# EAGLE design EEPROM_Programmer (EAGLE 9.6.2)

## Sheet 1 of 3: USB to UART and Microcontroller
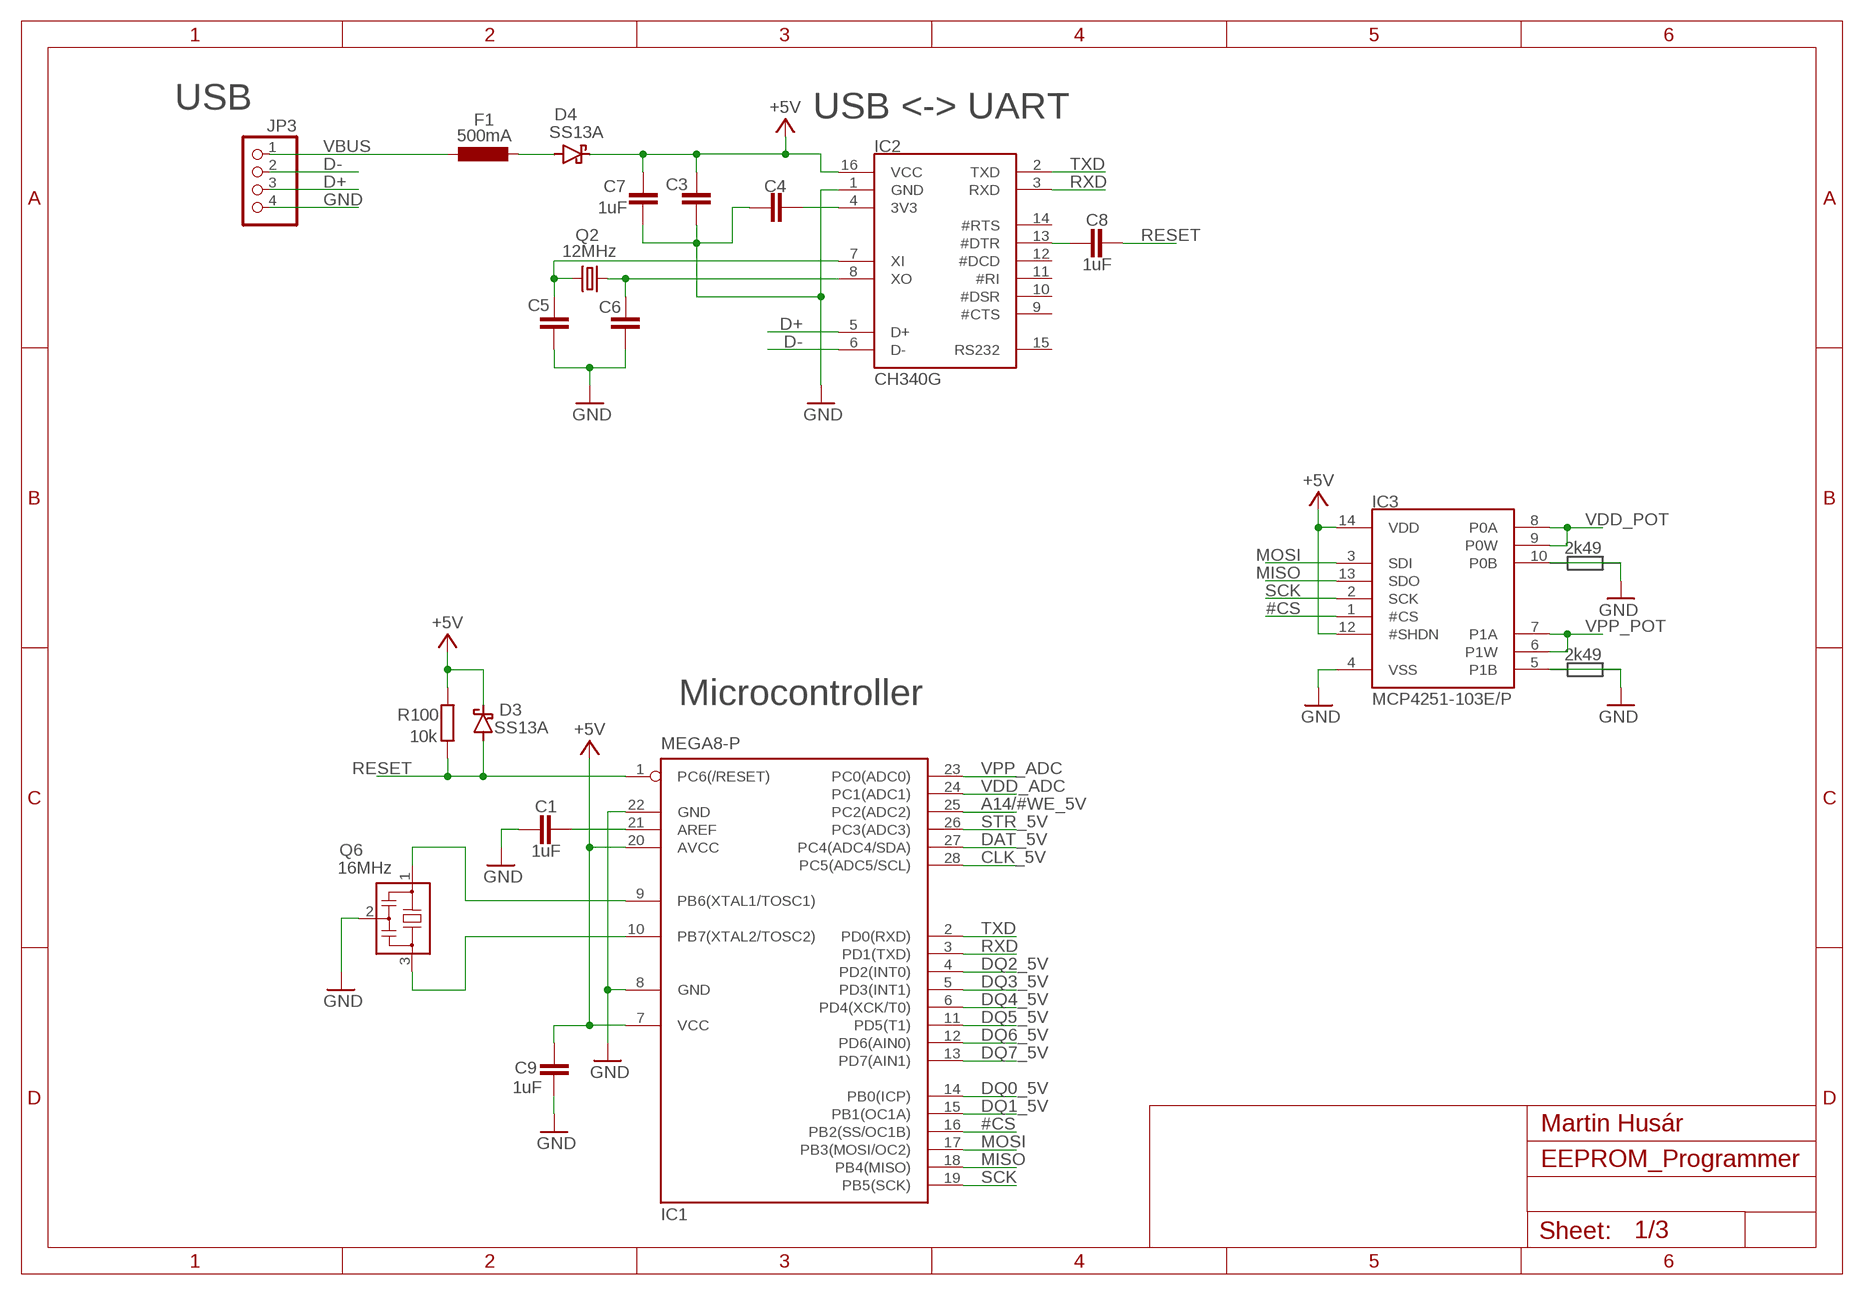
[diagram p0: schematic, sheet 1]

### Parts
C1  1uF  C-EUC0805  [C0805]
C3  C-EUC0603  [C0603]
C4  C-EUC0603  [C0603]
C5  C-EUC0603  [C0603]
C6  C-EUC0603  [C0603]
C7  1uF  C-EUC0805  [C0805]
C8  1uF  C-EUC0805  [C0805]
C9  1uF  C-EUC0805  [C0805]
D3  SS13A  CGRM4001-G  [SOD-123_MINI-SMA]
D4  SS13A  CGRM4001-G  [SOD-123_MINI-SMA]
F1  500mA  L-EUL1812  [L1812]
IC1  MEGA8-P  [DIL28-3]
IC2  CH340G  [SOP16]
IC3  MCP4251-103E/P  MCP425X  [DIL14]
JP3  PINHD-1X4  [1X04]
Q2  12MHz  CRYSTALHC49U-V  [HC49U-V]
Q6  16MHz  ZTTCS16.00MX  [ZTTCS*MX]
R100  10k  R-EU_R0805  [R0805]

### Nets
#CS: IC1.16(PB2(SS/OC1B)) IC3.1(#CS)
+5V [+5V]: C3.2 C7.2 C9.2 D3.C D4.C IC1.7(VCC) IC1.20(AVCC) IC2.16(VCC) IC3.12(#SHDN) IC3.14(VDD) R100.2 ; also sheet 2,3
A14/#WE_5V: IC1.25(PC2(ADC2)) ; also sheet 3
CLK_5V: IC1.28(PC5(ADC5/SCL)) ; also sheet 2
D+: IC2.5(D+) JP3.3
D-: IC2.6(D-) JP3.2
DAT_5V: IC1.27(PC4(ADC4/SDA)) ; also sheet 2
DQ0_5V: IC1.14(PB0(ICP)) ; also sheet 3
DQ1_5V: IC1.15(PB1(OC1A)) ; also sheet 3
DQ2_5V: IC1.4(PD2(INT0)) ; also sheet 3
DQ3_5V: IC1.5(PD3(INT1)) ; also sheet 3
DQ4_5V: IC1.6(PD4(XCK/T0)) ; also sheet 3
DQ5_5V: IC1.11(PD5(T1)) ; also sheet 3
DQ6_5V: IC1.12(PD6(AIN0)) ; also sheet 3
DQ7_5V: IC1.13(PD7(AIN1)) ; also sheet 3
GND [+5V]: C1.1 C3.1 C4.2 C5.2 C6.2 C7.1 C9.1 IC1.8(GND) IC1.22(GND) IC2.1(GND) IC3.4(VSS) IC3.5(P1B) IC3.10(P0B) JP3.4 Q6.2 ; also sheet 2,3
MISO: IC1.18(PB4(MISO)) IC3.13(SDO)
MOSI: IC1.17(PB3(MOSI/OC2)) IC3.3(SDI)
N$1: IC1.9(PB6(XTAL1/TOSC1)) Q6.1
N$2: IC1.10(PB7(XTAL2/TOSC2)) Q6.3
N$3: C1.2 IC1.21(AREF)
N$4: C8.1 IC2.13(#DTR)
N$5: C5.1 IC2.7(XI) Q2.2
N$9: C6.1 IC2.8(XO) Q2.1
N$11: C4.1 IC2.4(3V3)
N$14: D4.A F1.2
RESET: C8.2 D3.A IC1.1(PC6(/RESET)) R100.1
RXD: IC1.3(PD1(TXD)) IC2.3(RXD)
SCK: IC1.19(PB5(SCK)) IC3.2(SCK)
STR_5V: IC1.26(PC3(ADC3)) ; also sheet 2
TXD: IC1.2(PD0(RXD)) IC2.2(TXD)
VBUS: F1.1 JP3.1
VDD_ADC: IC1.24(PC1(ADC1)) ; also sheet 2
VDD_POT: IC3.8(P0A) IC3.9(P0W) ; also sheet 2
VPP_ADC: IC1.23(PC0(ADC0)) ; also sheet 2
VPP_POT: IC3.6(P1W) IC3.7(P1A) ; also sheet 2
Unconnected: IC2.9(#CTS) IC2.10(#DSR) IC2.11(#RI) IC2.12(#DCD) IC2.14(#RTS) IC2.15(RS232)

### Notes on the sheet
- USB | USB <-> UART
- 2k49
- 2k49
- Microcontroller
- Martin Husár

## Sheet 2 of 3: Shift refisters and voltage converters
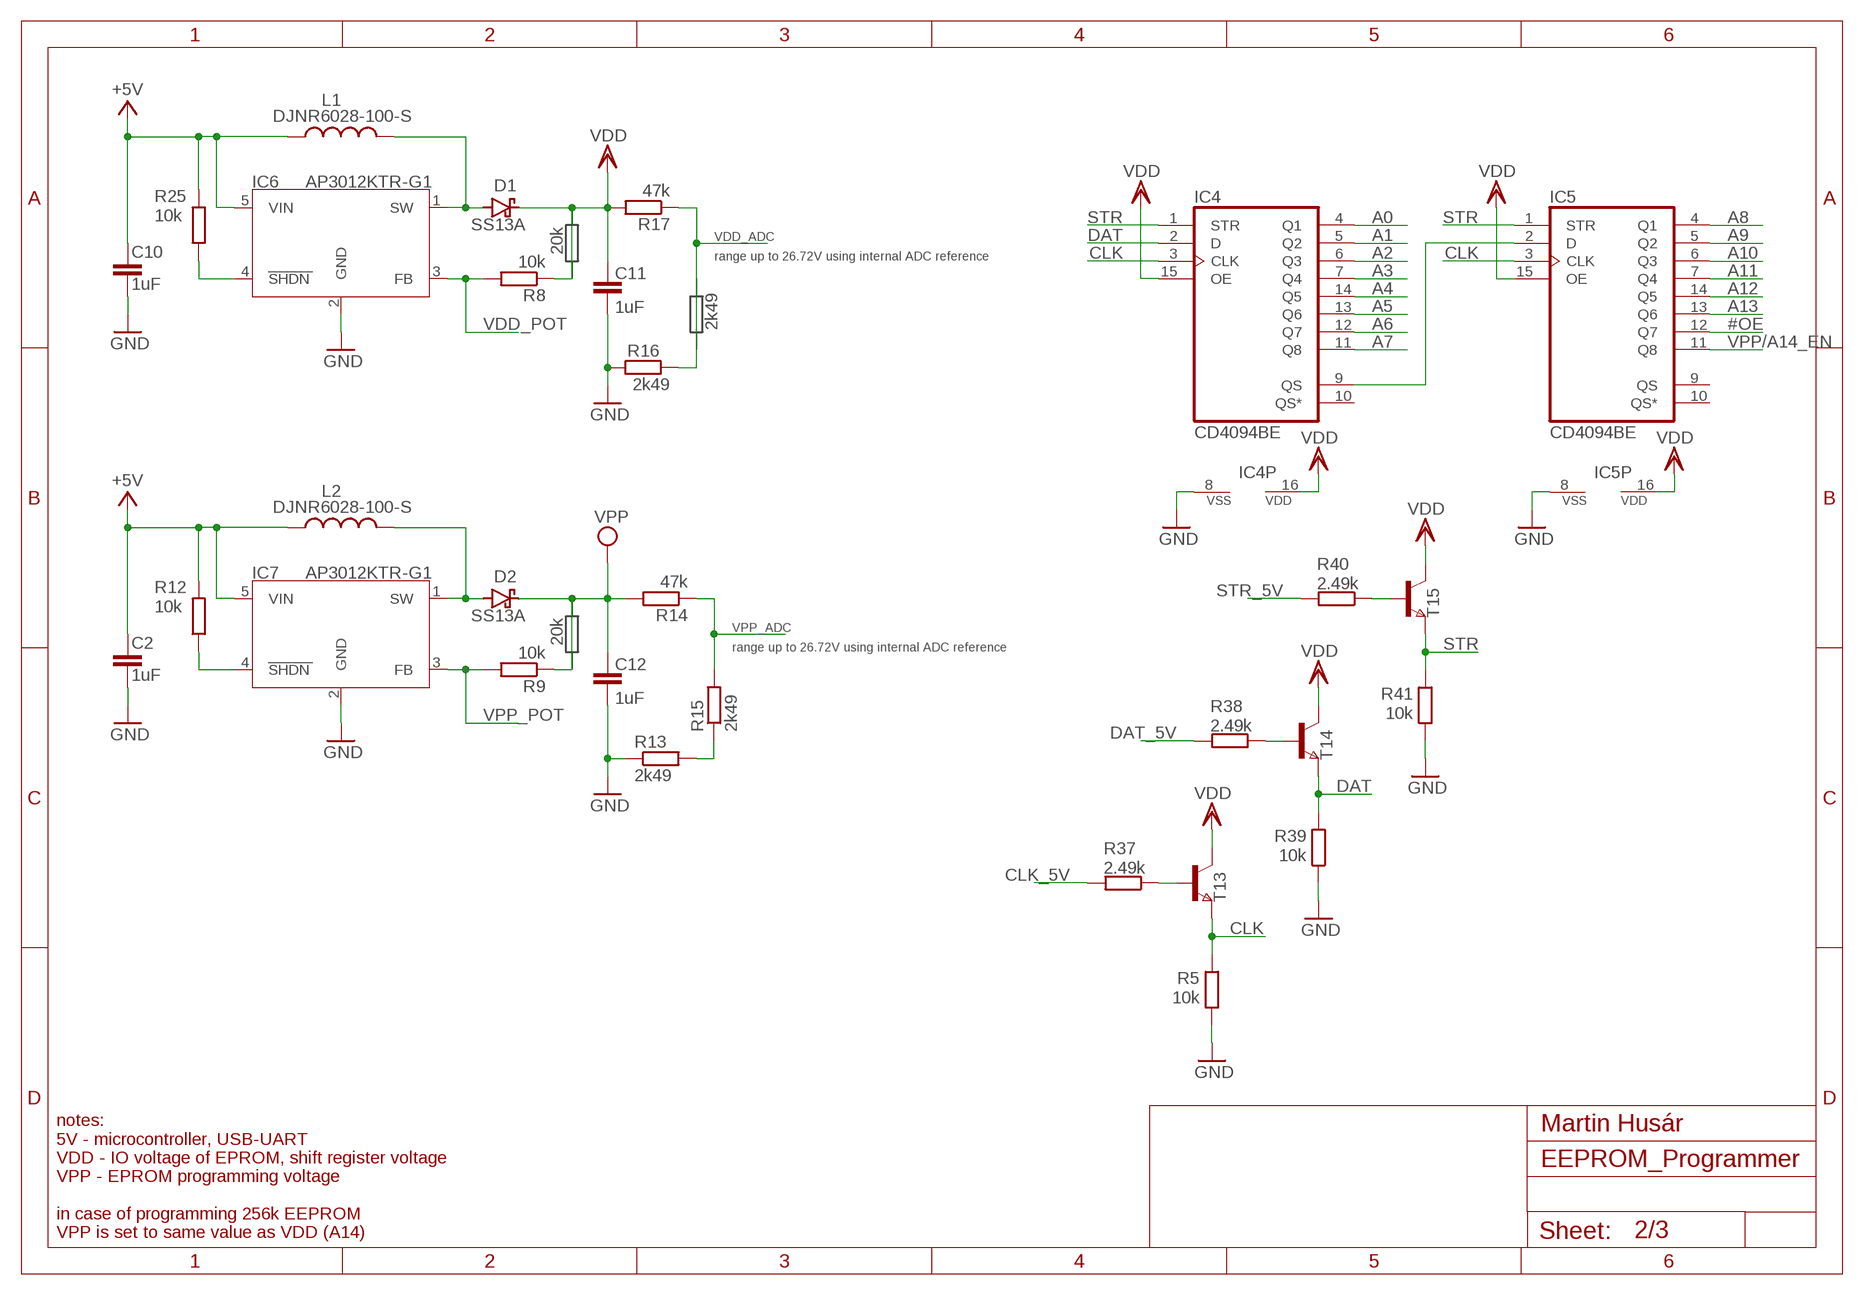
[diagram p1: schematic, sheet 2]

### Parts
C2  1uF  C-EUC0805  [C0805]
C10  1uF  C-EUC0805  [C0805]
C11  1uF  C-EUC0805  [C0805]
C12  1uF  C-EUC0805  [C0805]
D1  SS13A  CGRM4001-G  [SOD-123_MINI-SMA]
D2  SS13A  CGRM4001-G  [SOD-123_MINI-SMA]
IC4  CD4094BE  4094N  [DIL16]
IC5  CD4094BE  4094N  [DIL16]
IC6  AP3012KTR-G1  [SOT23-5]
IC7  AP3012KTR-G1  [SOT23-5]
L1  DJNR6028-100-S  INDUCTOR  [INDUCTOR]
L2  DJNR6028-100-S  INDUCTOR  [INDUCTOR]
R5  10k  R-EU_R0805  [R0805]
R8  10k  R-EU_R0805  [R0805]
R9  10k  R-EU_R0805  [R0805]
R12  10k  R-EU_R0805  [R0805]
R13  2k49  R-EU_R0805  [R0805]
R14  47k  R-EU_R1206  [R1206]
R15  2k49  R-EU_R0805  [R0805]
R16  2k49  R-EU_R0805  [R0805]
R17  47k  R-EU_R1206  [R1206]
R25  10k  R-EU_R0805  [R0805]
R37  2.49k  R-EU_R0805  [R0805]
R38  2.49k  R-EU_R0805  [R0805]
R39  10k  R-EU_R0805  [R0805]
R40  2.49k  R-EU_R0805  [R0805]
R41  10k  R-EU_R0805  [R0805]
T13  NPN  NPNSOT23  [SOT-23]
T14  NPN  NPNSOT23  [SOT-23]
T15  NPN  NPNSOT23  [SOT-23]

### Nets
#OE: IC5.12(Q7) ; also sheet 3
+5V [+5V]: C2.1 C10.1 IC6.5(VIN) IC7.5(VIN) L1.P$1 L2.P$1 R12.2 R25.2 ; also sheet 1,3
A0: IC4.4(Q1) ; also sheet 3
A1: IC4.5(Q2) ; also sheet 3
A2: IC4.6(Q3) ; also sheet 3
A3: IC4.7(Q4) ; also sheet 3
A4: IC4.14(Q5) ; also sheet 3
A5: IC4.13(Q6) ; also sheet 3
A6: IC4.12(Q7) ; also sheet 3
A7: IC4.11(Q8) ; also sheet 3
A8: IC5.4(Q1) ; also sheet 3
A9: IC5.5(Q2) ; also sheet 3
A10: IC5.6(Q3) ; also sheet 3
A11: IC5.7(Q4) ; also sheet 3
A12: IC5.14(Q5) ; also sheet 3
A13: IC5.13(Q6) ; also sheet 3
CLK: IC4.3(CLK) IC5.3(CLK) R5.2 T13.2(E)
CLK_5V: R37.2 ; also sheet 1
DAT: IC4.2(D) R39.2 T14.2(E)
DAT_5V: R38.2 ; also sheet 1
GND [+5V]: C2.2 C10.2 C11.2 C12.2 IC4.8(VSS) IC5.8(VSS) IC6.2(GND) IC7.2(GND) R5.1 R13.1 R16.1 R39.1 R41.1 ; also sheet 1,3
N$6: IC4.9(QS) IC5.2(D)
N$7: D1.A IC6.1(SW) L1.P$2
N$8: D2.A IC7.1(SW) L2.P$2
N$12: R13.2 R15.1
N$15: R38.1 T14.3(B)
N$16: R40.1 T15.3(B)
N$43: R37.1 T13.3(B)
SHDN: IC6.4(SHDN) R25.1
SHDN1: IC7.4(SHDN) R12.1
STR: IC4.1(STR) IC5.1(STR) R41.2 T15.2(E)
STR_5V: R40.2 ; also sheet 1
VDD: C11.1 D1.C IC4.15(OE) IC4.16(VDD) IC5.15(OE) IC5.16(VDD) R8.1 R17.2 T13.1(C) T14.1(C) T15.1(C) ; also sheet 3
VDD_ADC: R16.2 R17.1 ; also sheet 1
VDD_POT: IC6.3(FB) R8.2 ; also sheet 1
VPP: C12.1 D2.C R9.1 R14.2 ; also sheet 3
VPP/A14_EN: IC5.11(Q8) ; also sheet 3
VPP_ADC: R14.1 R15.2 ; also sheet 1
VPP_POT: IC7.3(FB) R9.2 ; also sheet 1
Unconnected: IC4.10(QS*) IC5.9(QS) IC5.10(QS*)

### Notes on the sheet
- 20k
- range up to 26.72V using internal ADC reference
- 2k49
- 20k
- range up to 26.72V using internal ADC reference
- Martin Husár
- notes:
  5V - microcontroller, USB-UART
  VDD - IO voltage of EPROM, shift register voltage
  VPP - EPROM programming voltage
  
  in case of programming 256k EEPROM
  VPP is set to same value as VDD (A14)

## Sheet 3 of 3: EPROM/EEPROM socket
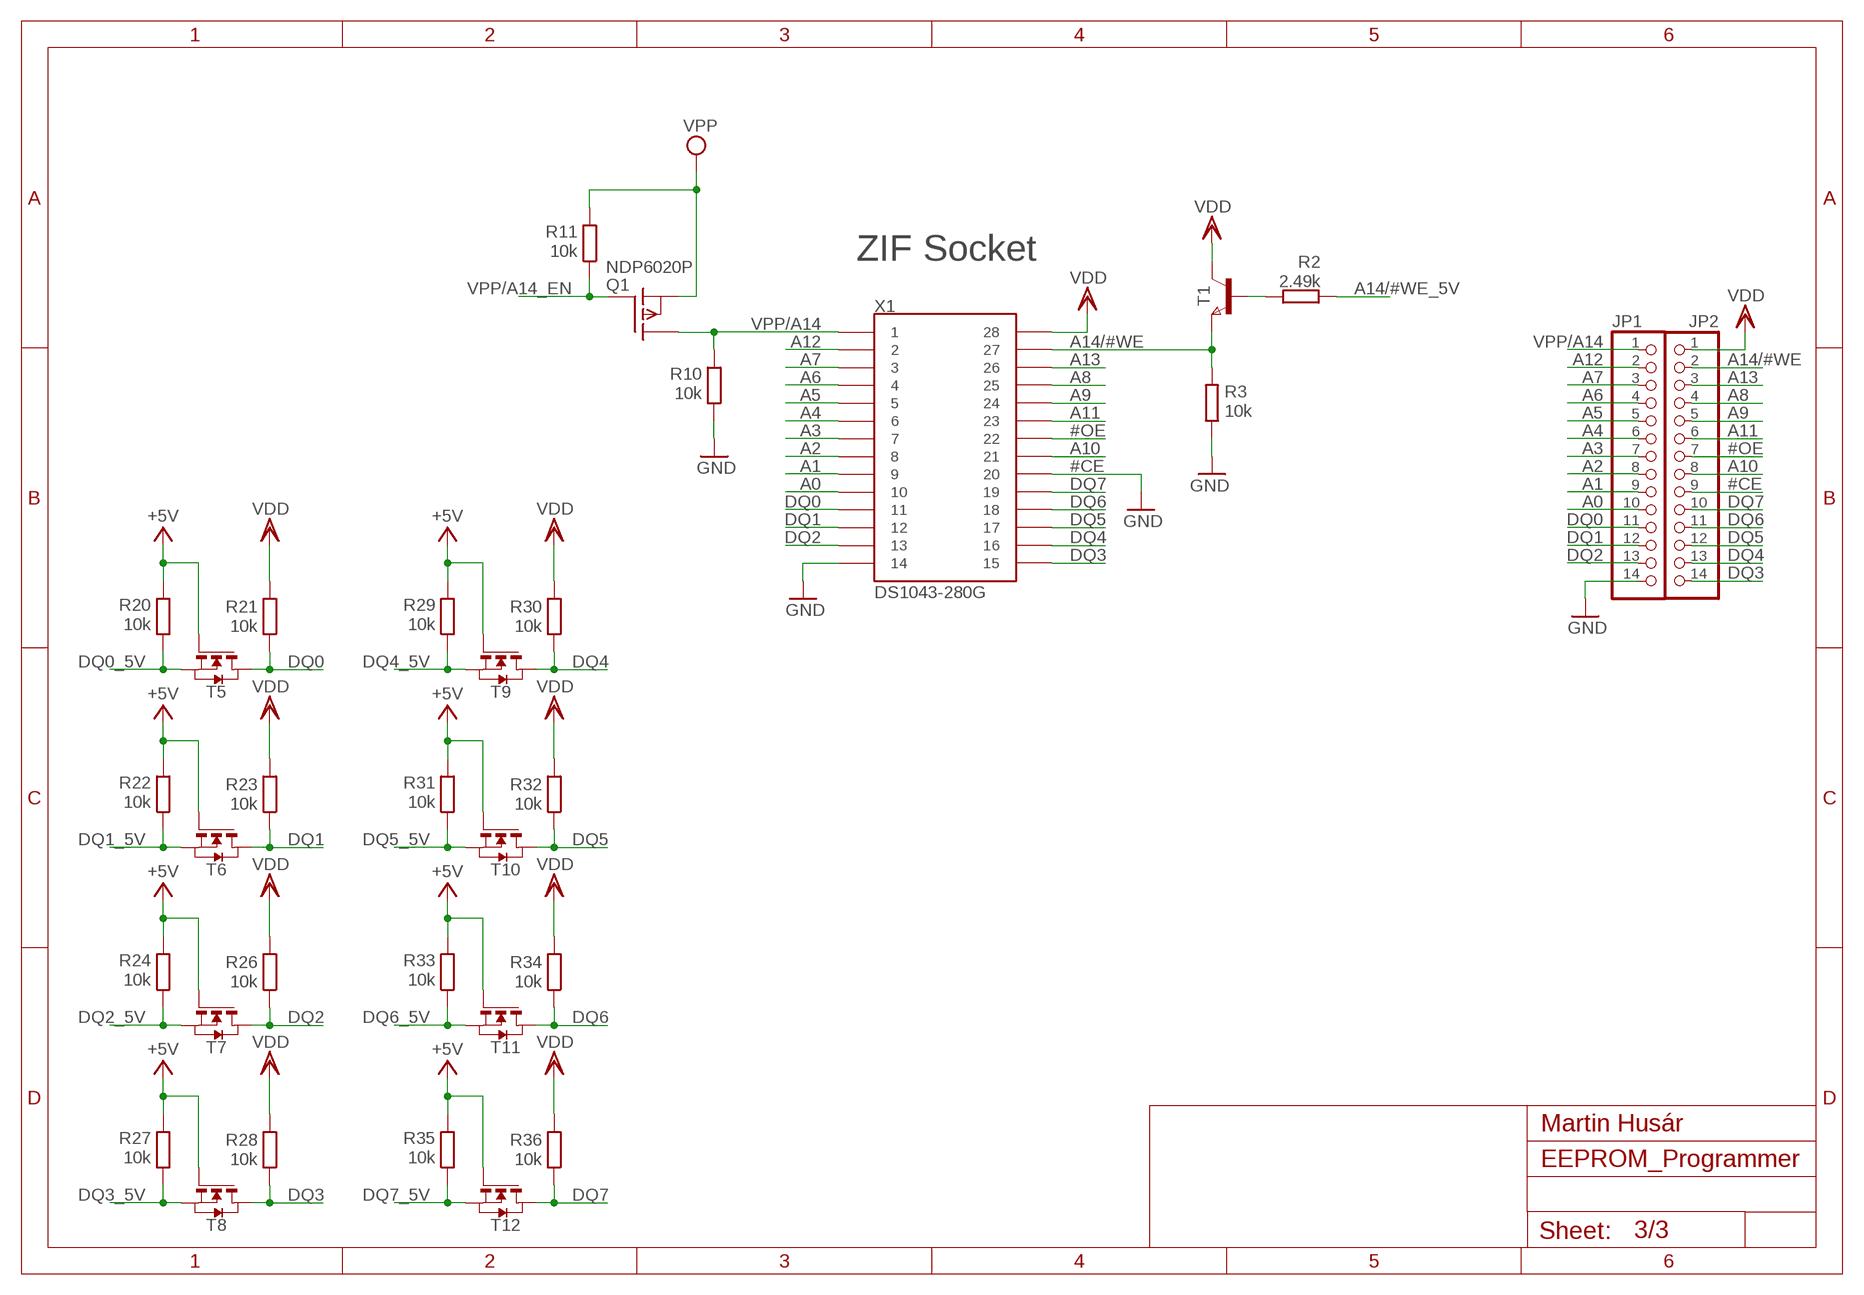
[diagram p2: schematic, sheet 3]

### Parts
JP1  PINHD-1X14  [1X14]
JP2  PINHD-1X14  [1X14]
Q1  NDP6020P  SUP65P06-20  [TO220]
R2  2.49k  R-EU_R0805  [R0805]
R3  10k  R-EU_R0805  [R0805]
R10  10k  R-EU_R0805  [R0805]
R11  10k  R-EU_R0805  [R0805]
R20  10k  R-EU_R0805  [R0805]
R21  10k  R-EU_R0805  [R0805]
R22  10k  R-EU_R0805  [R0805]
R23  10k  R-EU_R0805  [R0805]
R24  10k  R-EU_R0805  [R0805]
R26  10k  R-EU_R0805  [R0805]
R27  10k  R-EU_R0805  [R0805]
R28  10k  R-EU_R0805  [R0805]
R29  10k  R-EU_R0805  [R0805]
R30  10k  R-EU_R0805  [R0805]
R31  10k  R-EU_R0805  [R0805]
R32  10k  R-EU_R0805  [R0805]
R33  10k  R-EU_R0805  [R0805]
R34  10k  R-EU_R0805  [R0805]
R35  10k  R-EU_R0805  [R0805]
R36  10k  R-EU_R0805  [R0805]
T1  NPN  NPNSOT23  [SOT-23]
T5  NMOSSOT23  [SOT-23]
T6  NMOSSOT23  [SOT-23]
T7  NMOSSOT23  [SOT-23]
T8  NMOSSOT23  [SOT-23]
T9  NMOSSOT23  [SOT-23]
T10  NMOSSOT23  [SOT-23]
T11  NMOSSOT23  [SOT-23]
T12  NMOSSOT23  [SOT-23]
X1  DS1043-280G  [DS1043-280G]

### Nets
#OE: JP2.7 X1.P22 ; also sheet 2
+5V [+5V]: R20.2 R22.2 R24.2 R27.2 R29.2 R31.2 R33.2 R35.2 T5.3(G) T6.3(G) T7.3(G) T8.3(G) T9.3(G) T10.3(G) T11.3(G) T12.3(G) ; also sheet 1,2
A0: JP1.10 X1.P10 ; also sheet 2
A1: JP1.9 X1.P9 ; also sheet 2
A2: JP1.8 X1.P8 ; also sheet 2
A3: JP1.7 X1.P7 ; also sheet 2
A4: JP1.6 X1.P6 ; also sheet 2
A5: JP1.5 X1.P5 ; also sheet 2
A6: JP1.4 X1.P4 ; also sheet 2
A7: JP1.3 X1.P3 ; also sheet 2
A8: JP2.4 X1.P25 ; also sheet 2
A9: JP2.5 X1.P24 ; also sheet 2
A10: JP2.8 X1.P21 ; also sheet 2
A11: JP2.6 X1.P23 ; also sheet 2
A12: JP1.2 X1.P2 ; also sheet 2
A13: JP2.3 X1.P26 ; also sheet 2
A14/#WE: JP2.2 R3.2 T1.2(E) X1.P27
A14/#WE_5V: R2.2 ; also sheet 1
DQ0: JP1.11 R21.1 T5.1(D) X1.P11
DQ0_5V: R20.1 T5.2(S) ; also sheet 1
DQ1: JP1.12 R23.1 T6.1(D) X1.P12
DQ1_5V: R22.1 T6.2(S) ; also sheet 1
DQ2: JP1.13 R26.1 T7.1(D) X1.P13
DQ2_5V: R24.1 T7.2(S) ; also sheet 1
DQ3: JP2.14 R28.1 T8.1(D) X1.P15
DQ3_5V: R27.1 T8.2(S) ; also sheet 1
DQ4: JP2.13 R30.1 T9.1(D) X1.P16
DQ4_5V: R29.1 T9.2(S) ; also sheet 1
DQ5: JP2.12 R32.1 T10.1(D) X1.P17
DQ5_5V: R31.1 T10.2(S) ; also sheet 1
DQ6: JP2.11 R34.1 T11.1(D) X1.P18
DQ6_5V: R33.1 T11.2(S) ; also sheet 1
DQ7: JP2.10 R36.1 T12.1(D) X1.P19
DQ7_5V: R35.1 T12.2(S) ; also sheet 1
GND [+5V]: JP1.14 JP2.9 R3.1 R10.1 X1.P14 X1.P20 ; also sheet 1,2
N$17: R2.1 T1.3(B)
VDD: JP2.1 R21.2 R23.2 R26.2 R28.2 R30.2 R32.2 R34.2 R36.2 T1.1(C) X1.P28 ; also sheet 2
VPP: Q1.3(S) R11.2 ; also sheet 2
VPP/A14: JP1.1 Q1.2(D) R10.2 X1.P1
VPP/A14_EN: Q1.1(G) R11.1 ; also sheet 2

### Notes on the sheet
- ZIF Socket
- #CE
- #CE
- Martin Husár

## Library data of the parts
C1-C12 = rcl:C-EU: CAPACITOR, European symbol; SPICEPREFIX: C
D1-D4 = schottky-diode-my:CGRM400*-G: Molded plasitc,JEDEC SOD-123/Mini SMA Source: Comchip CGRM4001-G.pdf
F1 = rcl:L-EU: INDUCTOR, European symbol
IC1 = atmel:MEGA8-P: MICROCONTROLLER 8 Kbytes FLASH, 1 kbytes SRAM, 512 bytes EEPROM, USART, 4-channel 10 bit ADC, 2-channel 8 bit ADC Pin compatible with Atmega48, ATMega88, ATMega168 Source: avr.lbr; OC_FARNELL: unknown; OC_NEWARK: unknown
IC2 = EEPROM_Programmer:CH340G
IC3 = EEPROM_Programmer:MCP425X
IC4 IC5 = 40xx:4094: 8-stage SHIFT/STORE REGISTER, tri-state
IC6 IC7 = FlightComputer:AP3012KTR-G1
JP1 JP2 = pinhead:PINHD-1X14: PIN HEADER
JP3 = pinhead:PINHD-1X4: PIN HEADER
L1 L2 = FlightComputer:INDUCTOR
Q1 = transistor-fet:SUP65P06-20: P-Channel Enhancement MOSFET -60V; 60A; 0,020Ohm
Q2 = crystal:CRYSTAL: CRYSTAL; OC_FARNELL: 1666969; OC_NEWARK: unknown
Q6 = FlightComputer:ZTTCS16.00MX
R2 R3 R5 R8-R17 R20-R41 R100 = rcl:R-EU_: RESISTOR, European symbol; SPICEPREFIX: R
T1 T13-T15 = zetex:NPNSOT23: NPN TRANSISTOR; MPN: DSS20201L-7; OC_FARNELL: 1710688; OC_NEWARK: 25R4555
T5-T12 = zetex:NMOSSOT23: MOS FET; OC_FARNELL: unknown; OC_NEWARK: unknown
X1 = EEPROM_Programmer:DS1043-280G

## Net classes
0 default: width 0.61 mm, clearance 0.305 mm
1 +5V: width 0.508 mm, clearance 0.203 mm

## Board
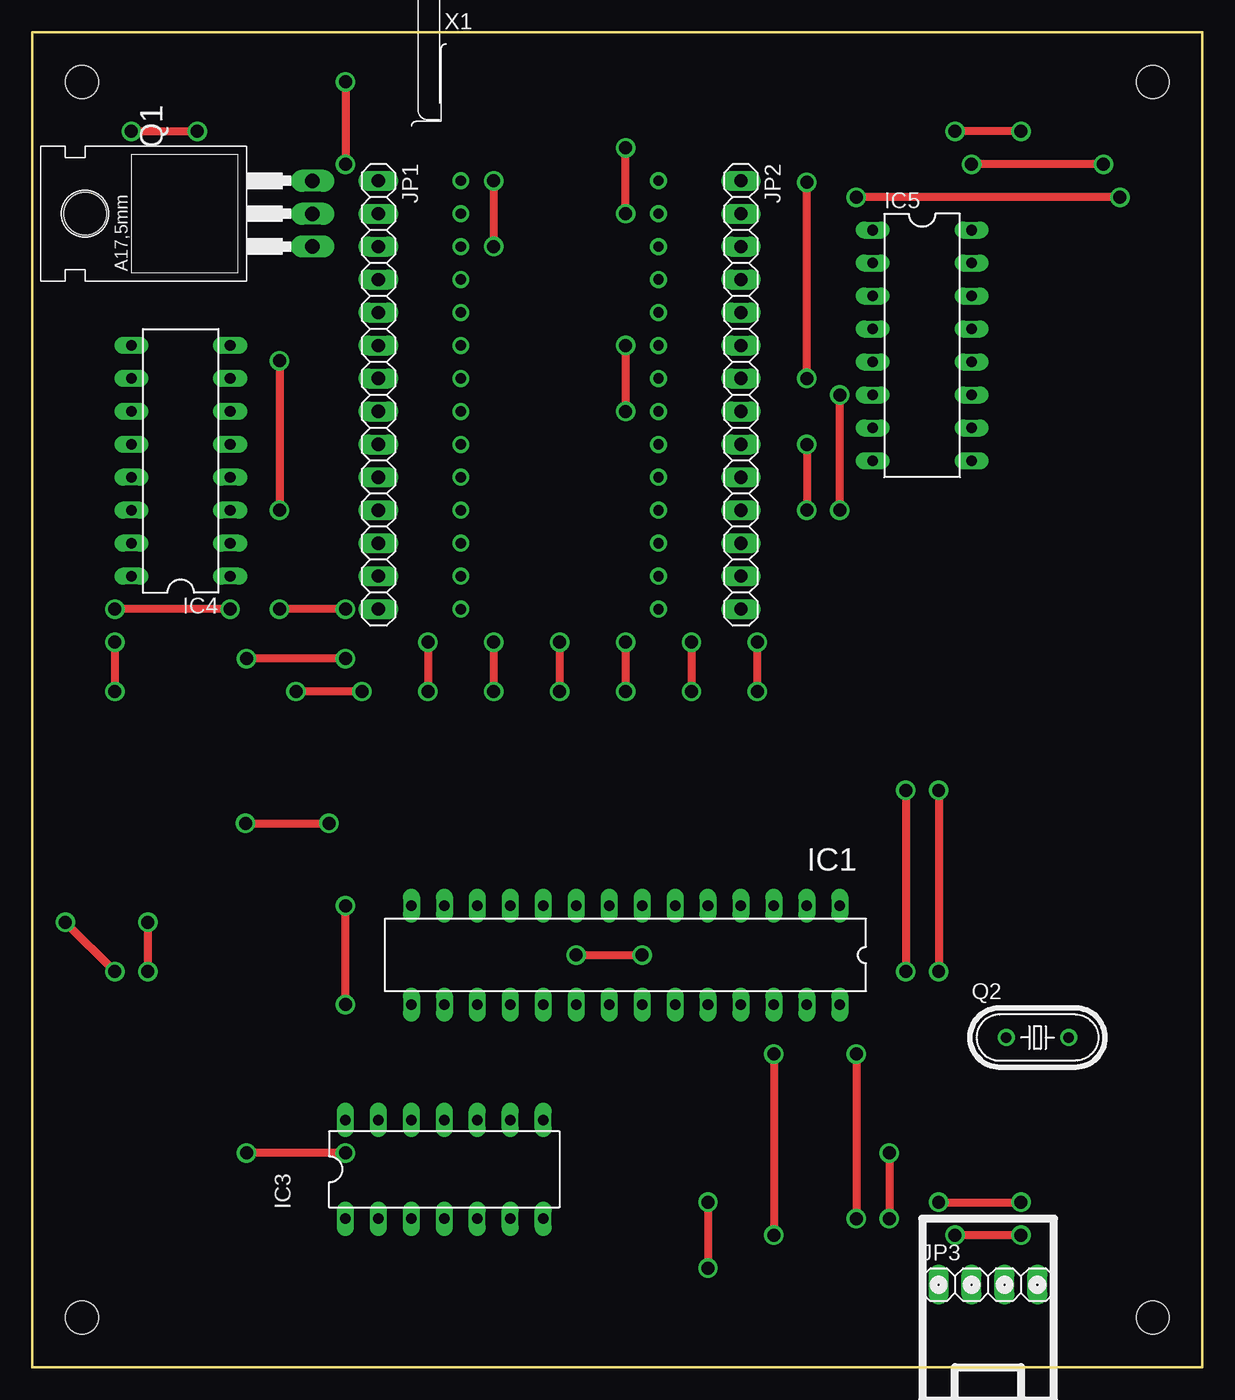
[diagram p3: board, top side]
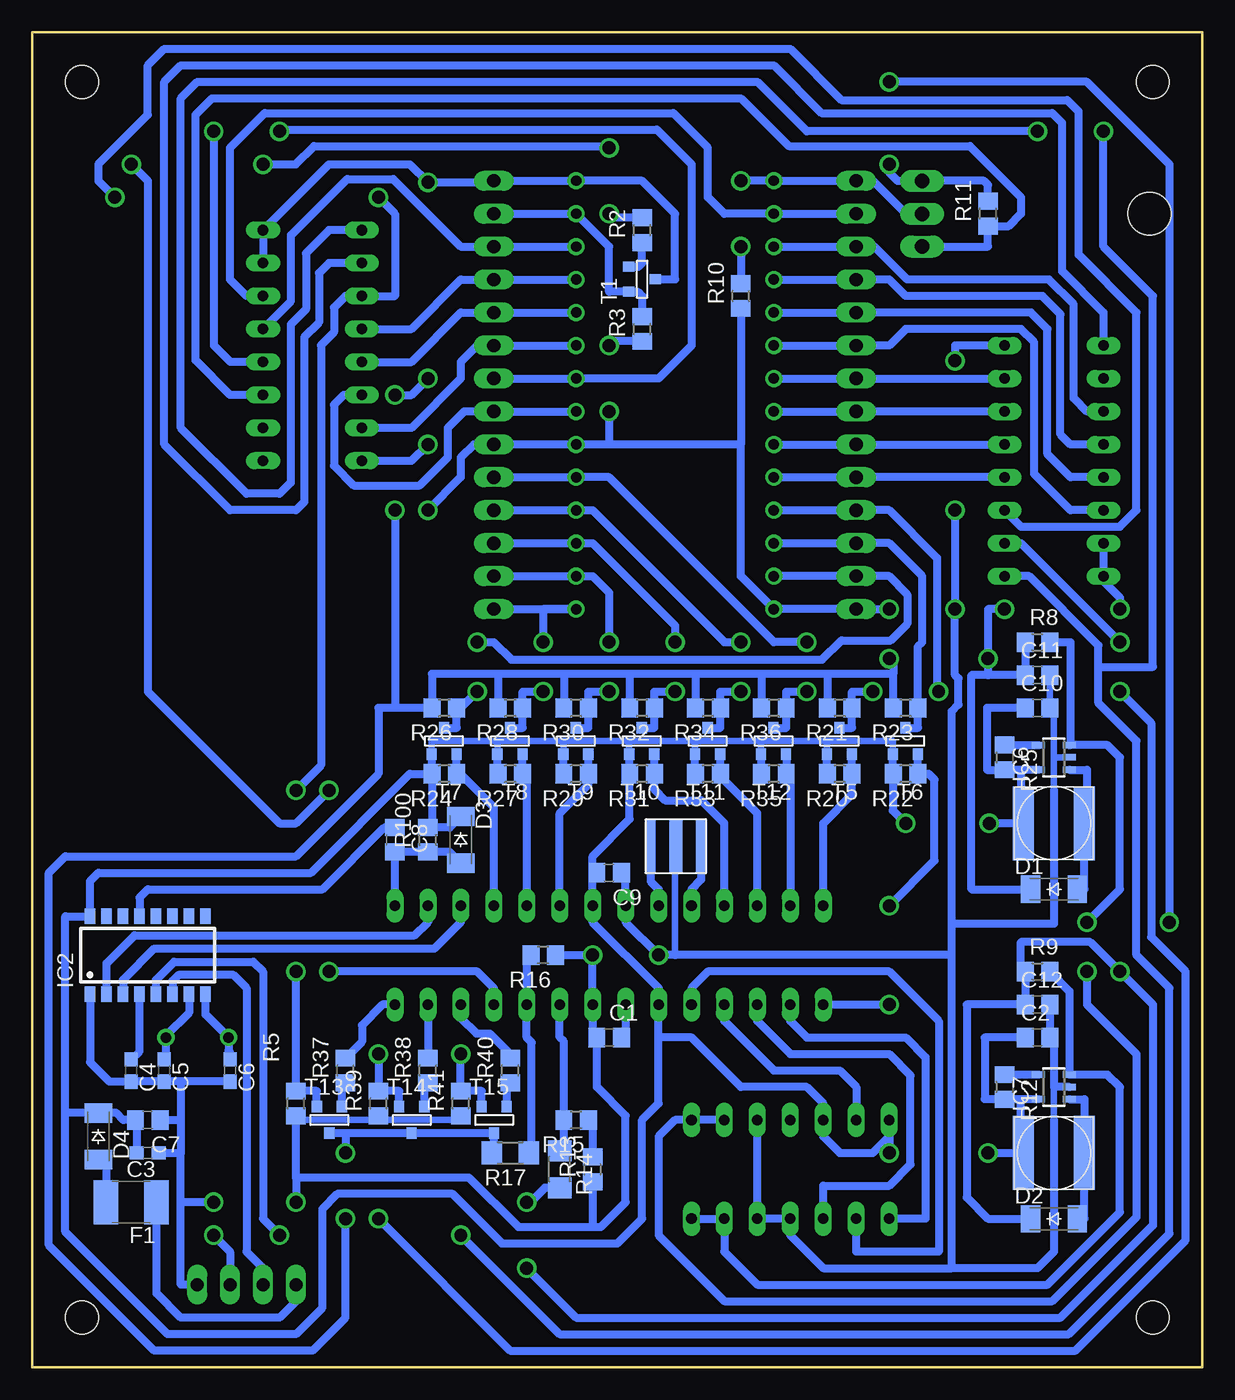
[diagram p4: board, bottom side, seen from below]

Size 90.17 x 102.87 mm. Coordinates in mm from the lower left corner, seen from the top.
Outline: 0,0 90.17,0 90.17,102.87 0,102.87 0,0
Copper layers (1*16): Top 0.035mm / dielectric 1.5mm / Bottom 0.035mm
Design rules "default *": minimum track width 6mil, minimum drill 0.35mm, track to track 6mil, track to pad 6mil, pad to pad 6mil, via to via 6mil, smd to smd 6mil, copper to edge 20mil, drill to drill 6mil, minimum pad ring 10mil, minimum via ring 8mil, stop-mask expansion 4mil, vias tented up to drill 0mil, thermal gap 10mil
Holes 2.54 mm at 3.81,3.81 86.36,3.81 86.36,99.06 3.81,99.06

### Footprints (pad centres in the part's own frame; a part is rotated, then mirrored left to right if it is on the bottom)
C0805 = smd 1.3 x 1.5: 1 -0.95,0; 2 0.95,0
C0603 = smd 1.1 x 1: 1 -0.85,0; 2 0.85,0
SOD-123_MINI-SMA = smd 1.5 x 2.1: A 1.8,0; C -1.8,0
L1812 = smd 1.9 x 3.4: 1 -1.95,0; 2 1.95,0
DIL28-3 = drill 0.813 long: 1 -16.51,-3.81; 2 -13.97,-3.81; 3 -11.43,-3.81; 4 -8.89,-3.81; 5 -6.35,-3.81; 6 -3.81,-3.81; 7 -1.27,-3.81; 8 1.27,-3.81; 9 3.81,-3.81; 10 6.35,-3.81; 11 8.89,-3.81; 12 11.43,-3.81; 13 13.97,-3.81; 14 16.51,-3.81; 15 16.51,3.81; 16 13.97,3.81; 17 11.43,3.81; 18 8.89,3.81; 19 6.35,3.81; 20 3.81,3.81; 21 1.27,3.81; 22 -1.27,3.81; 23 -3.81,3.81; 24 -6.35,3.81; 25 -8.89,3.81; 26 -11.43,3.81; 27 -13.97,3.81; 28 -16.51,3.81
SOP16 = smd 0.8 x 1.2: 1 -4.445,-3; 2 -3.175,-3; 3 -1.905,-3; 4 -0.635,-3; 5 0.635,-3; 6 1.905,-3; 7 3.175,-3; 8 4.445,-3; 9 4.445,3; 10 3.175,3; 11 1.905,3; 12 0.635,3; 13 -0.635,3; 14 -1.905,3; 15 -3.175,3; 16 -4.445,3
DIL14 = drill 0.813 long: 1 -7.62,-3.81; 2 -5.08,-3.81; 3 -2.54,-3.81; 4 0,-3.81; 5 2.54,-3.81; 6 5.08,-3.81; 7 7.62,-3.81; 8 7.62,3.81; 9 5.08,3.81; 10 2.54,3.81; 11 0,3.81; 12 -2.54,3.81; 13 -5.08,3.81; 14 -7.62,3.81
DIL16 = drill 0.813 long: 1 -8.89,-3.81; 2 -6.35,-3.81; 3 -3.81,-3.81; 4 -1.27,-3.81; 5 1.27,-3.81; 6 3.81,-3.81; 7 6.35,-3.81; 8 8.89,-3.81; 9 8.89,3.81; 10 6.35,3.81; 11 3.81,3.81; 12 1.27,3.81; 13 -1.27,3.81; 14 -3.81,3.81; 15 -6.35,3.81; 16 -8.89,3.81
SOT23-5 = smd 0.5 x 1: 1 -0.95,-1.2; 2 0,-1.2; 3 0.95,-1.2; 4 0.95,1.2; 5 -0.95,1.2
1X14 = drill 1.016 long: 1 -16.51,0; 2 -13.97,0; 3 -11.43,0; 4 -8.89,0; 5 -6.35,0; 6 -3.81,0; 7 -1.27,0; 8 1.27,0; 9 3.81,0; 10 6.35,0; 11 8.89,0; 12 11.43,0; 13 13.97,0; 14 16.51,0
1X04 = drill 1.016 long: 1 -3.81,0; 2 -1.27,0; 3 1.27,0; 4 3.81,0
INDUCTOR = smd 1.6 x 5.7: P$1 -2.35,0; P$2 2.35,0
TO220 = drill 1.118 long: 1 -2.54,-6.35; 2 0,-6.35; 3 2.54,-6.35 | hole 3.302: 0,11.176
HC49U-V = drill 0.813: 1 -2.413,0; 2 2.413,0
ZTTCS*MX = smd 0.8 x 4.1: 1 0.4,2.05; 3 4.3,2.05 | smd 1 x 4.1: 2 2.35,2.05
R0805 = smd 1.3 x 1.5: 1 -0.95,0; 2 0.95,0
R1206 = smd 1.6 x 1.803: 1 -1.422,0; 2 1.422,0
SOT-23 = smd 0.787 x 0.889: 1 0.025,-1.016; 2 -0.94,1.016; 3 0.991,1.016
DS1043-280G = drill 0.8 pad 1.27: P1 0,0; P2 0,-2.54; P3 0,-5.08; P4 0,-7.62; P5 0,-10.16; P6 0,-12.7; P7 0,-15.24; P8 0,-17.78; P9 0,-20.32; P10 0,-22.86; P11 0,-25.4; P12 0,-27.94; P13 0,-30.48; P14 0,-33.02; P15 15.24,-33.02; P16 15.24,-30.48; P17 15.24,-27.94; P18 15.24,-25.4; P19 15.24,-22.86; P20 15.24,-20.32; P21 15.24,-17.78; P22 15.24,-15.24; P23 15.24,-12.7; P24 15.24,-10.16; P25 15.24,-7.62; P26 15.24,-5.08; P27 15.24,-2.54; P28 15.24,0

### Placement (x,y rotation side)
C1  45.72,25.4 0 bottom
C2  12.7,25.4 0 bottom
C3  81.28,16.51 180 bottom
C4  82.55,22.86 270 bottom
C5  80.01,22.86 270 bottom
C6  74.93,22.86 270 bottom
C7  81.28,19.05 180 bottom
C8  62.23,40.64 270 bottom
C9  45.72,38.1 180 bottom
C10  12.7,50.8 0 bottom
C11  12.7,53.34 0 bottom
C12  12.7,27.94 0 bottom
D1  11.43,36.83 0 bottom
D2  11.43,11.43 0 bottom
D3  57.15,40.64 270 bottom
D4  85.09,17.78 270 bottom
F1  82.55,12.7 180 bottom
IC1  45.72,31.75 180 top
IC2  81.28,31.75 0 bottom
IC3  31.75,15.24 0 top
IC4  11.43,69.85 90 top
IC5  68.58,78.74 270 top
IC6  11.43,46.99 90 bottom
IC7  11.43,21.59 90 bottom
JP1  26.67,74.93 270 top
JP2  54.61,74.93 270 top
JP3  73.66,6.35 0 top
L1  11.43,41.91 0 bottom
L2  11.43,16.51 0 bottom
Q1  15.24,88.9 90 top
Q2  77.47,25.4 0 top
Q6  42.93,38.1 0 bottom
R2  43.18,87.63 90 bottom
R3  43.18,80.01 90 bottom
R5  69.85,20.32 90 bottom
R8  12.7,55.88 0 bottom
R9  12.7,30.48 0 bottom
R10  35.56,82.55 90 bottom
R11  16.51,88.9 90 bottom
R12  15.24,21.59 270 bottom
R13  46.99,15.24 90 bottom
R14  49.53,15.24 270 bottom
R15  48.26,19.05 180 bottom
R16  50.8,31.75 180 bottom
R17  53.34,16.51 180 bottom
R20  27.94,45.72 180 bottom
R21  27.94,50.8 180 bottom
R22  22.86,45.72 180 bottom
R23  22.86,50.8 180 bottom
R24  58.42,45.72 180 bottom
R25  15.24,46.99 270 bottom
R26  58.42,50.8 180 bottom
R27  53.34,45.72 180 bottom
R28  53.34,50.8 180 bottom
R29  48.26,45.72 180 bottom
R30  48.26,50.8 180 bottom
R31  43.18,45.72 180 bottom
R32  43.18,50.8 180 bottom
R33  38.1,45.72 180 bottom
R34  38.1,50.8 180 bottom
R35  33.02,45.72 180 bottom
R36  33.02,50.8 180 bottom
R37  66.04,22.86 90 bottom
R38  59.69,22.86 90 bottom
R39  63.5,20.32 90 bottom
R40  53.34,22.86 90 bottom
R41  57.15,20.32 90 bottom
R100  59.69,40.64 90 bottom
T1  43.18,83.82 90 bottom
T5  27.94,48.26 180 bottom
T6  22.86,48.26 180 bottom
T7  58.42,48.26 180 bottom
T8  53.34,48.26 180 bottom
T9  48.26,48.26 180 bottom
T10  43.18,48.26 180 bottom
T11  38.1,48.26 180 bottom
T12  33.02,48.26 180 bottom
T13  67.31,19.05 0 bottom
T14  60.96,19.05 0 bottom
T15  54.61,19.05 0 bottom
X1  33.02,91.44 0 top

### Tracks (layer width: path | path; a pad name or v marks a point on that pad's centre or on a via)
#CS
  Bottom 0.61: IC1.16 31.75,26.67 30.48,25.4 22.86,25.4 21.34,23.88 21.34,11.43 IC3.1
#OE  (via drill 1 pad 1.3)
  Top 0.61: v76.2,95.25 v71.12,95.25
  Bottom 0.61: JP2.7 X1.P22 41.91,76.2 39.37,78.74 39.37,92.71 42.04,95.38 70.99,95.38 v71.12,95.25 | IC5.12 74.91,77.47 76.2,78.76 v76.2,95.25
+5V  (via drill 1 pad 1.3)
  Top 0.61: v16.42,41.91 v22.86,41.91 | v24.13,16.51 v16.51,16.51
  Bottom 0.508: T6.3 23.85,48.26 28.93,48.26 | T7.3 59.41,48.26 54.33,48.26 | 28.93,48.26 34.01,48.26 | 34.01,48.26 39.09,48.26 | 39.09,48.26 44.17,48.26 | 44.17,48.26 49.25,48.26 | 49.25,48.26 54.33,48.26 | 54.33,48.26 T8.3 | 49.25,48.26 T9.3 | 44.17,48.26 T10.3 | 39.09,48.26 T11.3 | 34.01,48.26 T12.3 | 28.93,48.26 T5.3
  Bottom 0.61: R20.2 28.93,45.76 T5.3 | R22.2 23.85,45.76 | 23.85,45.76 T6.3 | R24.2 59.37,47.2 T7.3 | R27.2 54.33,45.76 T8.3 | R29.2 49.25,45.76 T9.3 | T10.3 44.13,47.2 R31.2 44.13,42.23 46.99,39.37 46.99,38.42 C9.2 46.99,37.78 IC1.7 46.99,34.29 41.91,29.21 IC1.20 41.91,25.4 | R33.2 39.09,45.76 T11.3 | T12.3 34.01,45.76 R35.2 | IC6.5 13.97,46.04 | 13.97,46.04 R25.2 16.6,46.04 16.6,50.8 C10.1 | 13.97,46.04 13.97,41.91 L1.P$1 v16.42,41.91 | IC7.5 13.97,20.64 | 13.97,20.64 R12.2 16.76,20.64 16.76,25.4 C2.1 | L2.P$1 13.97,16.7 | 13.97,16.7 13.97,16.51 v16.51,16.51 | 13.97,16.7 13.97,20.64 | 41.91,25.4 41.91,20.32 43.18,19.05 43.18,11.43 45.09,9.53 53.98,9.53 57.78,13.34 66.67,13.34 67.82,12.19 67.82,4.57 69.85,2.54 79.76,2.54 87.63,10.41 87.63,19.58 | D3.C 58,41.59 R100.2 59.37,41.91 R24.2 | v22.86,41.91 23.85,42.9 23.85,45.76 | 41.91,25.4 39.37,25.4 35.56,21.59 30.48,21.59 29.21,20.32 IC3.12 29.21,17.78 27.94,16.51 25.4,16.51 24.13,17.78 IC3.14 v24.13,16.51 | R24.2 61.09,45.72 68.71,38.1 85.09,38.1 85.72,37.47 IC2.16 87.63,34.75 87.63,19.58 | 87.63,19.58 D4.C 83.69,19.58 83.16,19.05 C7.2 82.13,18.95 C3.2
A0
  Bottom 0.61: X1.P10 JP1.10 IC4.4
A1
  Bottom 0.61: X1.P9 JP1.9 IC4.5
A2
  Bottom 0.61: X1.P8 JP1.8 IC4.6
A3
  Bottom 0.61: X1.P7 JP1.7 IC4.7
A4
  Bottom 0.61: X1.P6 JP1.6 24.13,78.74 22.86,80.01 13.97,80.01 12.95,78.99 12.95,68.83 10.16,66.04 IC4.14
A5
  Bottom 0.61: X1.P5 JP1.5 13.21,81.28 11.94,80.01 11.94,70.36 10.16,68.58 IC4.13
A6
  Bottom 0.61: X1.P4 JP1.4 24.13,83.82 22.86,82.55 12.32,82.55 10.92,81.15 10.92,71.88 10.16,71.12 IC4.12
A7
  Bottom 0.61: X1.P3 JP1.3 25.27,86.36 22.73,83.82 11.81,83.82 9.91,81.92 9.91,74.68 8.89,73.66 IC4.11
A8
  Bottom 0.61: X1.P25 JP2.4 57.15,83.82 60.96,80.01 IC5.4
A9
  Bottom 0.61: X1.P24 JP2.5 57.15,81.28 60.96,77.47 IC5.5
A10
  Bottom 0.61: X1.P21 JP2.8 56.9,73.66 58.17,72.39 58.17,70.1 60.33,67.94 65.41,67.94 66.93,69.47 66.93,74.17 66.17,74.93 IC5.6
A11
  Bottom 0.61: X1.P23 JP2.6 55.88,78.74 57.15,77.47 57.15,76.2 60.96,72.39 IC5.7
A12
  Bottom 0.61: JP1.2 X1.P2 36.83,88.9 38.1,90.17 38.1,93.98 40.77,96.65 72.26,96.65 74.93,93.98 74.93,83.82 73.66,82.55 IC5.14
A13
  Bottom 0.61: X1.P26 JP2.3 57.15,86.36 62.36,91.57 65.91,91.57 70.23,87.25 70.23,82.17 IC5.13
A14/#WE
  Bottom 0.61: JP2.2 X1.P27 45.72,86.36 45.72,82.88 T1.2 43.51,82.88 43.18,82.55 R3.2
A14/#WE_5V  (via drill 1 pad 1.3)
  Top 0.61: v67.31,44.45 v67.31,30.48 | v82.55,92.71 v72.39,92.71 | v45.72,88.9 v45.72,93.98
  Bottom 0.61: R2.2 45.4,88.58 v45.72,88.9 | IC1.25 54.61,29.21 55.88,30.48 v67.31,30.48 | v67.31,44.45 69.85,41.91 71.12,41.91 81.28,52.07 81.28,91.44 v82.55,92.71 | v72.39,92.71 69.87,92.71 68.48,94.11 45.85,94.11 v45.72,93.98
CLK  (via drill 1 pad 1.3)
  Top 0.61: v69.85,44.45 v69.85,30.48 | v83.82,90.17 v63.5,90.17
  Bottom 0.61: T13.2 68.25,21.27 R5.2 v69.85,30.48 | IC4.3 13.97,64.77 6.35,64.77 5.08,66.04 5.08,81.28 9.53,85.72 9.53,96.77 10.41,97.66 27.81,97.66 31.75,101.6 80.01,101.6 81.28,100.33 81.28,96.52 85.09,92.71 85.09,91.44 v83.82,90.17 | v69.85,44.45 67.92,46.38 67.92,78.77 66.93,79.76 66.93,81.66 66.04,82.55 IC5.3 62.23,82.55 62.23,88.9 v63.5,90.17
CLK_5V
  Bottom 0.61: R37.2 64.77,25.08 64.77,26.35 63.18,27.94 IC1.28
D+  (via drill 1 pad 1.3)
  Top 0.61: v76.2,10.16 v71.12,10.16
  Bottom 0.61: IC2.5 80.64,29.84 79.25,31.24 73.15,31.24 72.39,30.48 72.39,11.43 v71.12,10.16 | v76.2,10.16 74.93,8.89 JP3.3
D-
  Bottom 0.61: IC2.6 79.38,29.77 78.92,30.23 74.68,30.23 73.66,29.21 73.66,8.89 72.39,7.62 JP3.2
DAT  (via drill 1 pad 1.3)
  Top 0.61: v6.35,55.88 v6.35,52.07 | v63.5,24.13 v63.5,11.43
  Bottom 0.61: T14.2 61.9,21.27 R39.2 v63.5,24.13 | v63.5,11.43 53.34,1.27 9.78,1.27 1.27,9.78 1.27,30.48 3.94,33.15 3.94,49.66 v6.35,52.07 | IC4.2 13.97,63.5 v6.35,55.88
DAT_5V
  Bottom 0.61: IC1.27 R38.2
DQ0  (via drill 1 pad 1.3)
  Top 0.61: v25.4,52.07 v20.32,52.07
  Bottom 0.61: X1.P11 JP1.11 24.13,66.04 20.45,62.36 20.45,52.2 v20.32,52.07 | T5.1 26.99,49.28 R21.1 26.99,52.07 v25.4,52.07
DQ0_5V
  Bottom 0.61: T5.2 R20.1 26.99,44.13 29.21,41.91 IC1.14
DQ1
  Bottom 0.61: X1.P12 JP1.12 24.13,63.5 21.59,60.96 21.59,55.88 21.91,55.56 R23.1 21.91,49.28 T6.1
DQ1_5V  (via drill 1 pad 1.3)
  Top 0.61: v24.13,27.94 v24.13,35.56
  Bottom 0.61: T6.2 R22.1 21.08,45.72 20.64,45.28 20.64,39.05 v24.13,35.56 | IC1.15 v24.13,27.94
DQ2  (via drill 1 pad 1.3)
  Top 0.61: v55.88,52.07 v55.88,55.88
  Bottom 0.61: X1.P13 JP1.13 24.13,60.96 22.73,59.56 22.73,57.28 24,56.01 27.81,56.01 29.3,54.52 53.25,54.52 54.61,55.88 v55.88,55.88 | T7.1 57.47,49.28 R26.1 57.15,50.8 v55.88,52.07
DQ2_5V
  Bottom 0.61: T7.2 R24.1 57.15,45.72 54.61,43.18 IC1.4
DQ3  (via drill 1 pad 1.3)
  Top 0.61: v50.8,55.88 v50.8,52.07
  Bottom 0.61: JP2.14 X1.P15 50.8,58.42 v50.8,55.88 | T8.1 52.39,49.28 R28.1 52.39,52.07 v50.8,52.07
DQ3_5V
  Bottom 0.61: T8.2 R27.1 52.07,45.4 IC1.5
DQ4  (via drill 1 pad 1.3)
  Top 0.61: v45.72,55.88 v45.72,52.07
  Bottom 0.61: JP2.13 X1.P16 46.99,60.96 45.72,59.69 v45.72,55.88 | T9.1 47.31,49.28 R30.1 47.31,52.07 v45.72,52.07
DQ4_5V
  Bottom 0.61: T9.2 R29.1 47.31,44.89 49.53,42.67 IC1.6
DQ5  (via drill 1 pad 1.3)
  Top 0.61: v40.64,55.88 v40.64,52.07
  Bottom 0.61: JP2.12 X1.P17 46.99,63.5 40.64,57.15 v40.64,55.88 | T10.1 42.23,49.28 R32.1 42.23,52.07 v40.64,52.07
DQ5_5V
  Bottom 0.61: R31.1 | R31.1 T10.2 | R31.1 42.24,44.53 41.4,43.69 38.61,43.69 36.83,41.91 IC1.11
DQ6  (via drill 1 pad 1.3)
  Top 0.61: v35.56,55.88 v35.56,52.07
  Bottom 0.61: JP2.11 X1.P18 46.99,66.04 36.83,55.88 v35.56,55.88 | T11.1 37.15,49.28 R34.1 37.15,52.07 v35.56,52.07
DQ6_5V
  Bottom 0.61: IC1.12 34.29,42.67 37.15,45.53 R33.1 T11.2
DQ7  (via drill 1 pad 1.3)
  Top 0.61: v30.48,55.88 v30.48,52.07
  Bottom 0.61: JP2.10 X1.P19 45.72,68.58 33.02,55.88 v30.48,55.88 | T12.1 32.07,49.28 R36.1 32.07,52.07 v30.48,52.07
DQ7_5V
  Bottom 0.61: T12.2 R35.1 31.75,45.4 IC1.13
GND  (via drill 1 pad 1.3)
  Top 0.61: v41.91,31.75 v46.99,31.75 | v19.05,77.56 v19.05,66.04 | v24.13,58.42 v19.05,58.42 | v59.69,71.12 v59.69,66.04 | v45.72,78.74 v45.72,73.66 | v69.85,12.7 v76.2,12.7
  Bottom 0.508: R5.1 69.53,19.05 63.82,19.05 R39.1 63.18,19.05 57.47,19.05 R41.1 | 11.43,46.99 11.43,50.48 C10.2 C11.2 | 11.43,46.99 IC6.2 | 11.43,46.99 11.43,44.45 | 11.43,21.59 11.43,19.05 | Q6.2 40.64,40.09 40.64,31.75
  Bottom 0.61: IC3.10 IC3.5 IC3.4 31.75,10.16 29.21,7.62 19.3,7.62 | C12.2 C2.2 11.43,25.08 11.43,21.59 IC7.2 | C6.2 C5.2 | C5.2 C4.2 84.24,22.01 85.72,23.5 IC2.1 | IC4.8 19.05,78.74 v19.05,77.56 | v19.05,66.04 v19.05,58.42 | v24.13,58.42 JP1.14 X1.P14 35.56,60.96 35.56,71.12 | 19.3,34.16 11.43,34.16 11.43,44.45 | 11.43,19.05 11.43,8.89 12.7,7.62 19.3,7.62 | R3.1 45.4,79.06 v45.72,78.74 | IC5.8 60.96,69.85 v59.69,71.12 | v59.69,66.04 57.15,68.58 57.15,70.1 56.13,71.12 JP2.9 X1.P20 45.72,71.12 | 46.99,10.79 52.7,10.79 56.52,14.61 69.85,14.61 | 46.99,10.79 46.35,10.79 44.45,12.7 44.45,19.37 46.67,21.59 C1.1 46.99,25.72 IC1.22 v46.99,31.75 R16.1 | R13.1 46.99,10.79 | 35.56,71.12 45.72,71.12 | v45.72,73.66 45.72,71.12 | R10.1 35.56,71.12 | v19.05,58.42 18.92,58.29 | 19.3,34.16 19.3,50.55 18.8,51.05 18.8,53.09 19.05,53.34 v19.05,58.42 | 19.3,7.62 19.3,31.75 | 19.3,31.75 19.3,34.16 | 19.3,31.75 40.64,31.75 v41.91,31.75 44.45,34.29 IC1.8 44.45,37.78 C9.1 | 69.85,14.61 R5.1 | 78.74,19.05 78.74,22.01 C5.2 | 78.74,19.05 78.74,16.51 | C3.1 78.74,16.51 | C7.1 78.74,19.05 | JP3.4 78.74,6.35 78.74,12.7 | 78.74,12.7 78.74,16.51 | 69.85,14.61 v69.85,12.7 | v76.2,12.7 78.74,12.7
MISO
  Bottom 0.61: IC1.18 36.83,26.67 33.02,22.86 27.94,22.86 26.67,21.59 IC3.13
MOSI
  Bottom 0.61: IC1.17 34.29,26.67 31.75,24.13 24.13,24.13 22.48,22.48 22.48,15.62 24.13,13.97 29.21,13.97 IC3.3
N$1
  Bottom 0.61: Q6.1 42.53,37.45 41.91,36.83 IC1.9
N$2
  Bottom 0.61: IC1.10 39.37,36.83 38.63,37.57 Q6.3
N$3
  Bottom 0.61: IC1.21 44.45,25.72 C1.2
N$4
  Bottom 0.61: IC2.13 81.92,36.2 81.28,36.83 67.82,36.83 63.06,41.59 C8.1
N$5
  Bottom 0.61: C5.1 80.01,24 79.88,24.13 Q2.2 79.88,25.53 78.11,27.3 IC2.7
N$6
  Bottom 0.61: IC5.2 67.31,85.09 68.07,84.33 68.07,80.52 69.22,79.38 69.22,66.67 69.85,66.04 74.93,66.04 80.01,71.12 80.01,99.06 78.74,100.33 33.02,100.33 29.34,96.65 11.56,96.65 10.79,95.89 10.79,84.45 7.62,81.28 IC4.9
N$7
  Bottom 0.61: D1.A 9.08,36.83 L1.P$2 8.89,42.1 8.89,46.04 IC6.1
N$8
  Bottom 0.61: IC7.1 9.08,20.64 L2.P$2 9.08,11.43 D2.A
N$9
  Bottom 0.61: C6.1 74.93,24.26 75.06,24.38 Q2.1 76.83,27.18 IC2.8
N$11
  Bottom 0.61: C4.1 81.92,24.34 IC2.4
N$12
  Bottom 0.61: R15.1 46.99,18.73 R13.2
N$14
  Bottom 0.61: D4.A 84.5,15.39 F1.2
N$15
  Bottom 0.61: R38.1 59.97,21.63 T14.3
N$16
  Bottom 0.61: R40.1 53.62,21.63 T15.3
N$17
  Bottom 0.61: R2.1 43.18,85.09 43.46,84.81 T1.3
N$43
  Bottom 0.61: R37.1 66.32,21.63 T13.3
RESET
  Bottom 0.61: D3.A 58,39.69 R100.1 C8.2 IC1.1
RXD
  Bottom 0.61: IC2.3 83.19,29.84 80.77,32.26 59.18,32.26 57.15,34.29 IC1.3
SCK
  Bottom 0.61: IC3.2 26.67,8.89 20.32,8.89 20.32,26.67 24.13,30.48 38.1,30.48 39.37,29.21 IC1.19
SHDN
  Bottom 0.61: R25.1 IC6.4
SHDN1
  Bottom 0.61: IC7.4 R12.1
STR  (via drill 1 pad 1.3)
  Top 0.61: v57.15,24.13 v57.15,10.16 | v7.62,95.25 v12.7,95.25
  Bottom 0.61: T15.2 55.55,21.27 R41.2 v57.15,24.13 | v57.15,10.16 49.53,2.54 10.29,2.54 2.54,10.29 2.54,29.21 5.08,31.75 5.08,48.26 8,51.18 8,53.98 | IC5.1 67.31,87.63 69.09,85.85 69.09,81.53 70.26,80.37 70.26,68.17 71.12,67.31 73.66,67.31 78.74,72.39 78.74,97.79 77.47,99.06 34.29,99.06 30.48,95.25 v12.7,95.25 | IC4.1 13.34,60.96 8,55.63 8,53.98 | v7.62,95.25 7.62,86.36 3.81,82.55 3.81,53.98 8,53.98
STR_5V
  Bottom 0.61: R40.2 53.34,24.13 54.93,25.72 55.94,25.72 57.15,26.92 IC1.26
TXD
  Bottom 0.61: IC2.2 84.45,31.11 82.3,33.27 60.71,33.27 59.69,34.29 IC1.2
VBUS
  Bottom 0.61: JP3.1 69.85,5.08 71.12,3.81 78.74,3.81 80.6,5.67 F1.1
VDD  (via drill 1 pad 1.3)
  Top 0.61: v24.13,54.61 v16.51,54.61 | v66.04,16.51 v66.04,11.43 | v15.24,58.42 v6.35,58.42 | v62.23,66.04 v62.23,74.93 | v59.69,76.2 v59.69,91.31
  Bottom 0.61: IC4.15 IC4.16 7.62,60.58 6.35,59.31 v6.35,58.42 | IC5.15 IC5.16 67.31,92.71 61.09,92.71 v59.69,91.31 54.74,91.31 JP2.1 X1.P28 43.18,91.44 40.64,88.9 40.64,83.84 T1.1 | 28.8,53.43 33.97,53.43 | 33.97,53.43 39.05,53.43 | 39.05,53.43 44.13,53.43 | 44.13,53.43 49.21,53.43 | 49.21,53.43 54.29,53.43 | 54.29,53.43 59.37,53.43 R26.2 62.23,50.8 | 54.29,53.43 R28.2 | 49.21,53.43 R30.2 | 44.13,53.43 R32.2 | 39.05,53.43 R34.2 | 33.97,53.43 R36.2 | 23.81,53.43 28.8,53.43 | 28.8,53.43 28.89,53.34 R21.2 | 16.51,53.34 C11.1 R8.1 | 16.51,53.34 17.78,53.34 17.78,36.83 D1.C | 16.51,53.34 v16.51,54.61 16.51,58.42 v15.24,58.42 | T14.1 T13.1 66.02,18.03 66.02,16.54 v66.04,16.51 | T14.1 T15.1 | v66.04,11.43 66.04,3.81 68.58,1.27 80.77,1.27 88.9,9.4 88.9,38.1 87.63,39.37 69.85,39.37 63.5,45.72 63.5,50.8 62.23,50.8 | T14.1 54.63,18.03 54.63,16.64 R17.2 | v62.23,66.04 62.23,50.8 | R23.2 23.81,53.43 | v24.13,54.61 23.81,54.29 23.81,53.43 | v62.23,74.93 60.96,74.93 v59.69,76.2
VDD_ADC
  Bottom 0.61: R16.2 52.07,31.43 IC1.24 52.07,25.4 51.69,25.02 51.69,16.74 R17.1
VDD_POT  (via drill 1 pad 1.3)
  Top 0.61: v8.89,34.29 v8.89,30.48
  Bottom 0.61: IC3.9 IC3.8 40.64,19.05 41.91,17.78 41.91,10.16 36.83,5.08 11.56,5.08 5.08,11.56 5.08,24.13 8.89,27.94 v8.89,30.48 | R8.2 10.16,55.88 10.16,48.01 IC6.3 7.3,47.94 6.35,46.99 6.35,36.83 v8.89,34.29
VPP  (via drill 1 pad 1.3)
  Top 0.61: v24.13,99.06 v24.13,92.71 | v52.07,12.7 v52.07,7.62 | v6.35,30.48 v2.54,34.29
  Bottom 0.61: D2.C 16.51,11.43 18.16,13.08 18.16,27.94 C12.1 R9.1 13.97,30.8 13.97,32.77 8.64,32.77 v6.35,30.48 3.81,27.94 3.81,10.92 10.92,3.81 48.26,3.81 v52.07,7.62 | v24.13,92.71 24.13,92.08 23.5,91.44 Q1.3 16.83,91.44 16.51,91.12 R11.2 | v52.07,12.7 51.79,12.7 50.67,13.82 R14.2 | v24.13,99.06 8.89,99.06 2.54,92.71 v2.54,34.29
VPP/A14  (via drill 1 pad 1.3)
  Top 0.61: v35.56,91.44 v35.56,86.36
  Bottom 0.61: v35.56,91.44 X1.P1 JP1.1 25.4,91.44 22.86,88.9 Q1.2 | v35.56,86.36 R10.2
VPP/A14_EN
  Bottom 0.61: IC5.11 74.93,74.93 77.6,77.6 77.6,96.52 76.33,97.79 35.56,97.79 31.88,94.11 17.91,94.11 13.97,90.17 13.97,88.9 14.92,87.95 R11.1 16.51,86.36 Q1.1
VPP_ADC
  Bottom 0.61: R14.1 49.21,16.98 R15.2 49.21,25.1 49.53,25.42 IC1.23
VPP_POT
  Bottom 0.61: IC3.7 IC3.6 36.83,8.89 34.29,6.35 11.94,6.35 6.35,11.94 6.35,21.59 7.3,22.54 IC7.3 10.23,28.96 R9.2